# EAGLE design FINAL_MA (EAGLE 9.3.2)
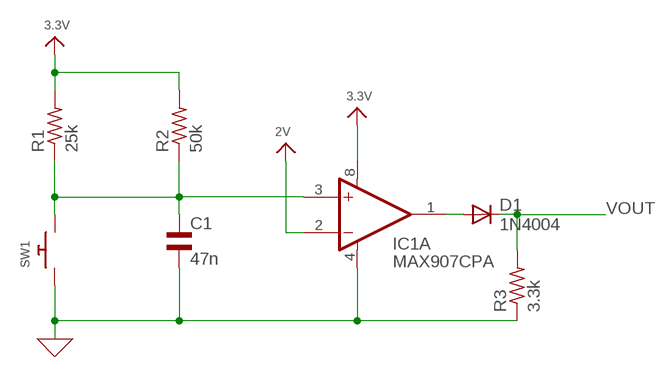
[diagram p0: schematic, sheet 1]

## Parts
C1  47n  EL-BI25-10AXIAL  [EU25-10]
D1  1N4004  [DO41-10]
IC1  MAX907CPA  [DIL08]
R1  25k  R-US_0204/5  [0204/5]
R2  50k  R-US_0204/5  [0204/5]
R3  3.3k  R-US_0204/5  [0204/5]
SW1  SWITCH_PUSHBUTTONEVQ-PE  [TACT_PANA-EVQ]

## Nets
0: C1.2 IC1.4(A:V-) R3.1 SW1.P$1 ; supply symbol labelled GND
N$1: D1.A IC1.1(A:OUT)
N$2: C1.1 IC1.3(A:+IN) R1.1 R2.1 SW1.P$2
VCC: IC1.2(A:-IN) IC1.8(A:V+) R1.2 R2.2 ; supply symbol labelled 3.3V, 2V
VOUT: D1.C R3.2
Unconnected: IC1.5(B:+IN) IC1.6(B:-IN) IC1.7(B:OUT)

## Library data of the parts
C1 = rcl:EL-: BIPOLAR ELECTROLYTIC CAPACITOR; SPICEPREFIX: C
D1 = adafruit:1N4004: DIODE General purpose 1N400x type rectifier (With bigger pads) http://www.ladyada.net/library/pcb/eaglelibrary.html
IC1 = maxim:MAX907CPA: COMPARATOR; MF: MAXIM; MPN: MAX907CPA; OC_FARNELL: unknown; OC_NEWARK: 79C3004
R1-R3 = adafruit:R-US_: RESISTOR, American symbol
SW1 = adafruit:SWITCH_PUSHBUTTON: Buttons SOFTTOUCHSMD_SJ - Soft touch temporary push button (Super Junk Akihabara) Compatible with SKPMANE010 [Mouser: 688-SKPMAN] C&K_KSS = Digikey: KSS221GLFS

## Board
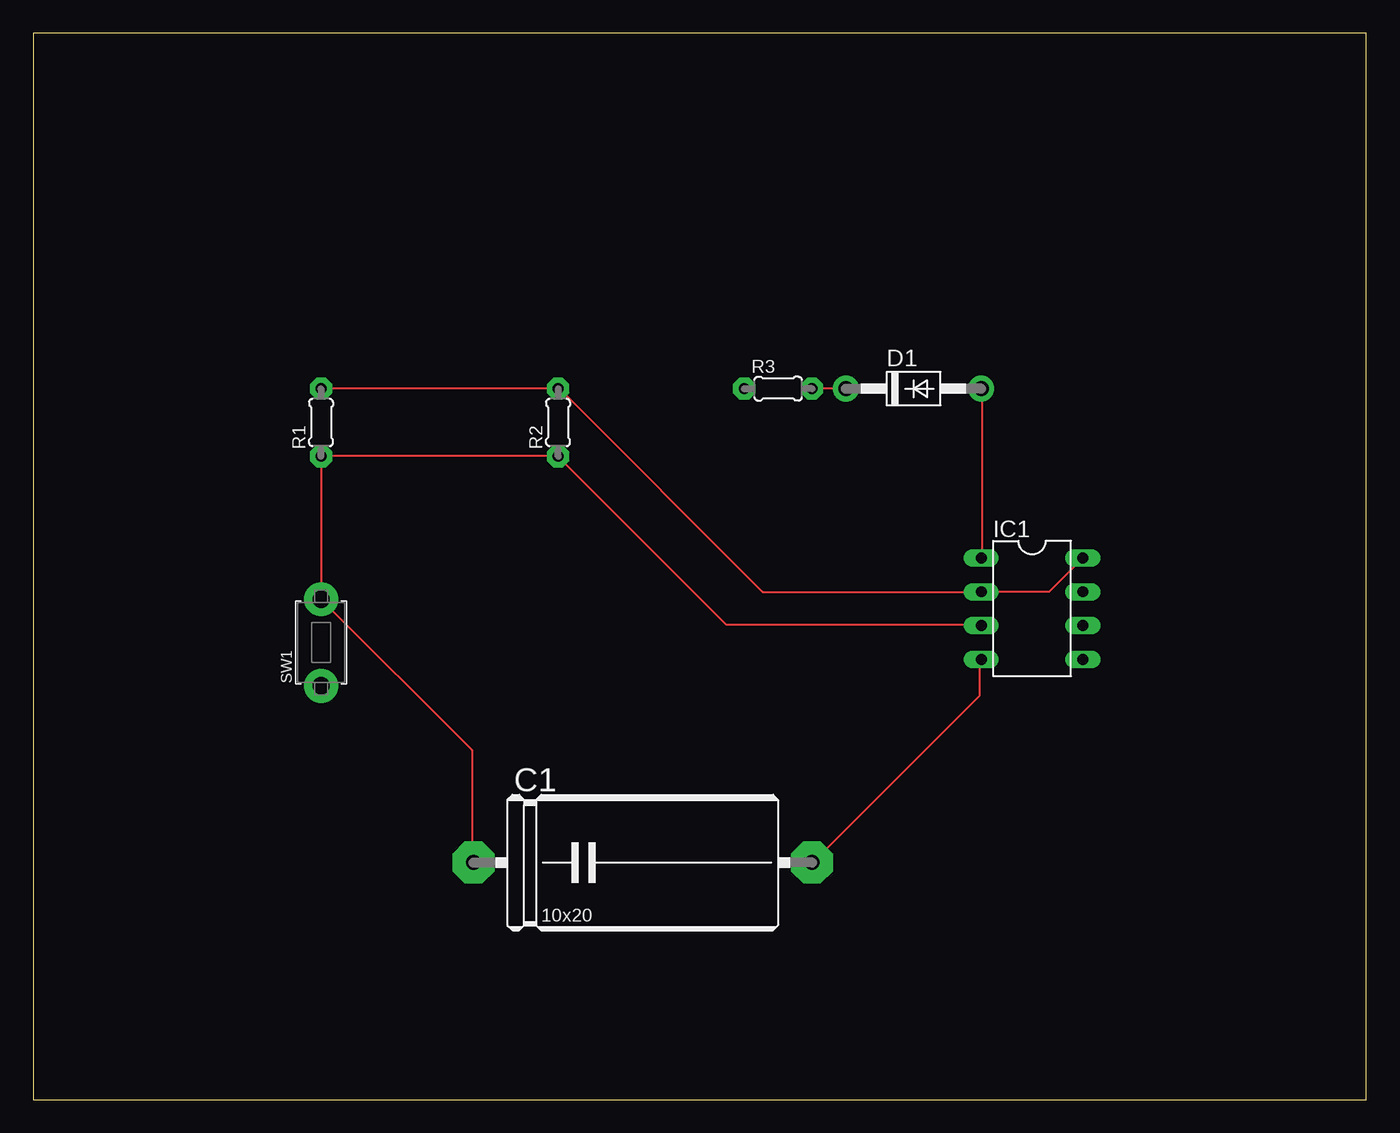
[diagram p1: board, top side]
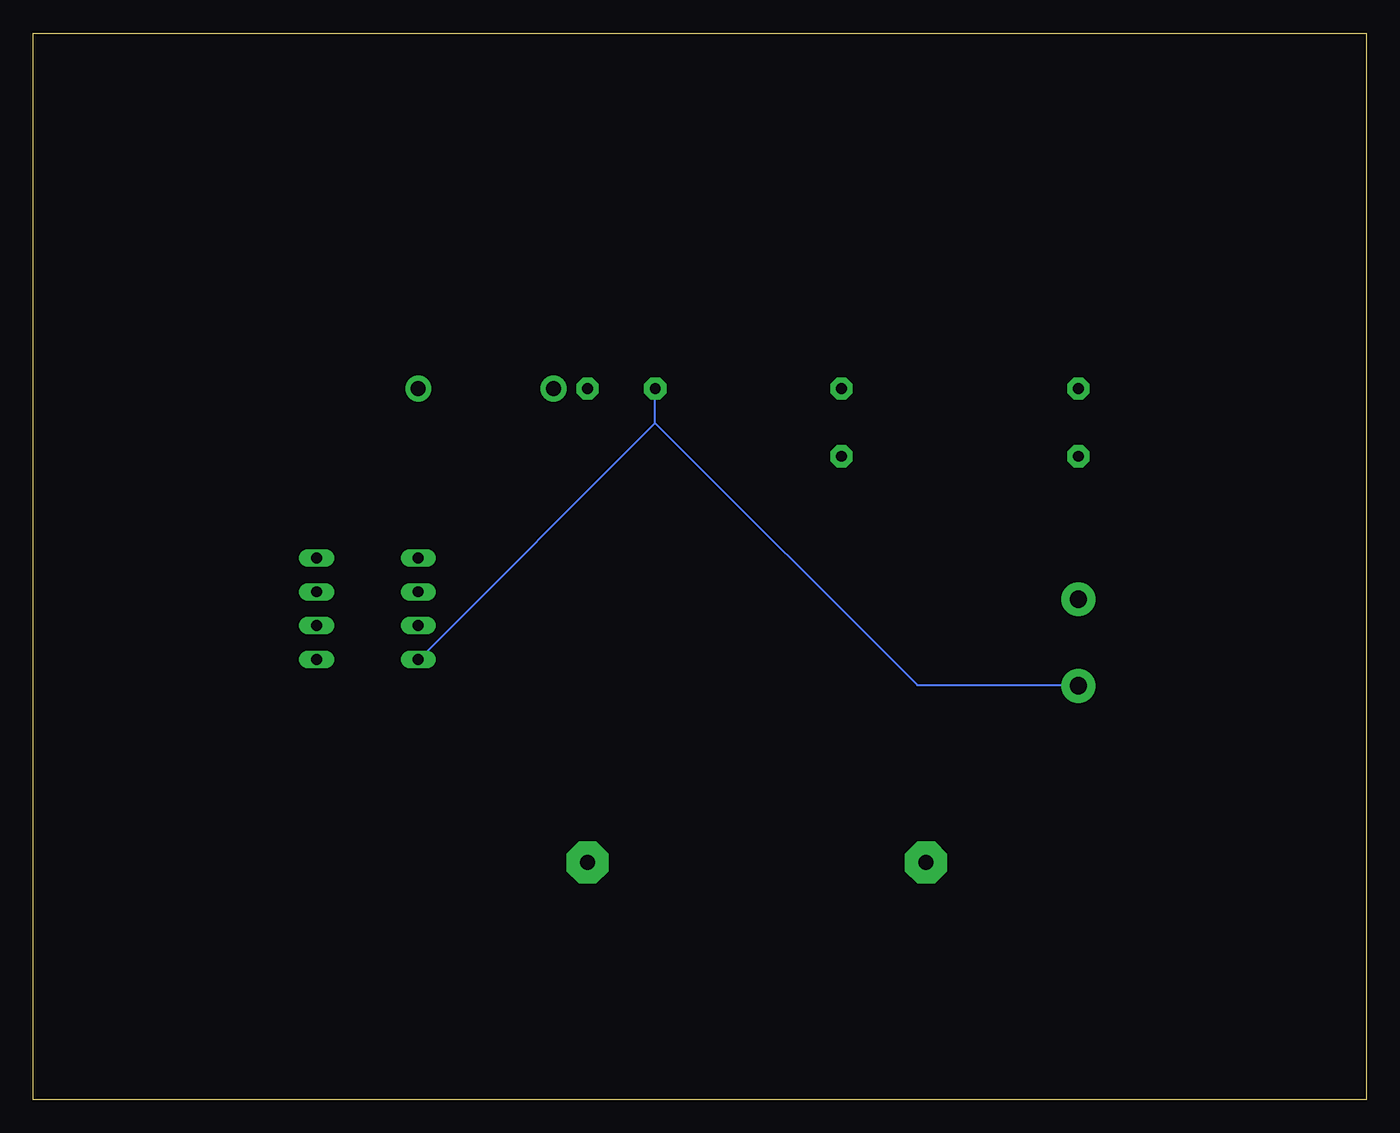
[diagram p2: board, bottom side, seen from below]

Size 100 x 80 mm. Coordinates in mm from the lower left corner, seen from the top.
Outline: 0,0 100,0 100,80 0,80 0,0
Copper layers (1*16): Top 0.035mm / dielectric 1.5mm / Bottom 0.035mm
Design rules "default": minimum track width 6mil, minimum drill 0.35mm, track to track 6mil, track to pad 6mil, pad to pad 6mil, via to via 6mil, smd to smd 6mil, copper to edge 40mil, drill to drill 6mil, minimum pad ring 10mil, minimum via ring 8mil, stop-mask expansion 4mil, vias tented up to drill 0mil, thermal gap 10mil

### Footprints (pad centres in the part's own frame; a part is rotated, then mirrored left to right if it is on the bottom)
EU25-10 = drill 1.118 pad 3.15 octagon: 1 -12.7,0; 2 12.7,0
DO41-10 = drill 1.118 pad 1.93: A 5.08,0; C -5.08,0
DIL08 = drill 0.813 long: 1 -3.81,-3.81; 2 -1.27,-3.81; 3 1.27,-3.81; 4 3.81,-3.81; 5 3.81,3.81; 6 1.27,3.81; 7 -1.27,3.81; 8 -3.81,3.81
0204/5 = drill 0.813 pad 1.676 octagon: 1 -2.54,0; 2 2.54,0
TACT_PANA-EVQ = drill 1.3 pad 2.54: P$1 -3.25,0; P$2 3.25,0

### Placement (x,y rotation side)
C1  45.72,17.78 0 top
D1  66.04,53.34 0 top
IC1  74.93,36.83 270 top
R1  21.59,50.8 90 top
R2  39.37,50.8 90 top
R3  55.88,53.34 0 top
SW1  21.59,34.29 90 top

### Tracks (layer width: path | path; a pad name or v marks a point on that pad's centre or on a via)
0
  Top 0.152: IC1.4 71.02,32.92 71.02,30.33 58.52,17.83 C1.2
  Bottom 0.152: 53.34,50.75 R3.1 | 53.34,50.75 71.02,33.07 IC1.4 | 53.34,50.75 33.68,31.09 21.64,31.09 SW1.P$1
N$1
  Top 0.152: IC1.1 71.17,40.69 71.17,53.34 D1.A
N$2
  Top 0.152: IC1.3 71.02,35.66 51.97,35.66 R2.1 39.32,48.31 21.64,48.31 R1.1 21.64,48.16 21.64,37.64 SW1.P$2 21.64,37.49 32.92,26.21 32.92,17.83 C1.1
VCC
  Top 0.152: IC1.8 76.2,38.1 IC1.2 54.71,38.1 39.47,53.34 R2.2 R1.2
VOUT
  Top 0.152: D1.C R3.2